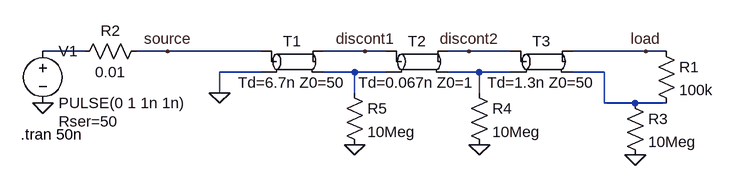
[diagram p0: schematic TransmissionLineReflections.asc]
TransmissionLineReflections.asc, the LTspice schematic file:
Version 4
SHEET 1 880 680
WIRE -160 144 -224 144
WIRE -32 144 -80 144
WIRE 112 144 -32 144
WIRE 272 144 208 144
WIRE 304 144 272 144
WIRE 432 144 400 144
WIRE 496 144 432 144
WIRE 704 144 592 144
WIRE 736 144 704 144
WIRE 112 176 48 176
WIRE 256 176 208 176
WIRE 304 176 256 176
WIRE 448 176 400 176
WIRE 496 176 448 176
WIRE 640 176 592 176
WIRE 48 208 48 176
WIRE 256 208 256 176
WIRE 448 208 448 176
WIRE 640 224 640 176
WIRE 688 224 640 224
WIRE 736 224 688 224
FLAG 48 208 0
FLAG -224 224 0
FLAG 704 144 load
FLAG -32 144 source
FLAG 272 144 discont1
FLAG 432 144 discont2
FLAG 256 288 0
FLAG 448 288 0
FLAG 688 304 0
SYMBOL tline 160 160 R0
SYMATTR InstName T1
SYMATTR Value Td=6.7n Z0=50
SYMBOL tline 352 160 R0
SYMATTR InstName T2
SYMATTR Value Td=0.067n Z0=1
SYMBOL tline 544 160 R0
SYMATTR InstName T3
SYMATTR Value Td=1.3n Z0=50
SYMBOL res 720 128 R0
SYMATTR InstName R1
SYMATTR Value 100k
SYMBOL voltage -224 128 R0
WINDOW 123 0 0 Left 2
WINDOW 39 24 124 Left 2
SYMATTR InstName V1
SYMATTR Value PULSE(0 1 1n 1n)
SYMATTR SpiceLine Rser=50
SYMBOL res -64 128 R90
WINDOW 0 0 56 VBottom 2
WINDOW 3 32 56 VTop 2
SYMATTR InstName R2
SYMATTR Value 0.01
SYMBOL res 672 208 R0
SYMATTR InstName R3
SYMATTR Value 10Meg
SYMBOL res 432 192 R0
SYMATTR InstName R4
SYMATTR Value 10Meg
SYMBOL res 240 192 R0
SYMATTR InstName R5
SYMATTR Value 10Meg
TEXT -258 272 Left 2 !.tran 50n

The netlist it stands for:
* TransmissionLineReflections.asc
T1 source 0 discont1 N002 Td=6.7n Z0=50
T2 discont1 N002 discont2 N003 Td=0.067n Z0=1
T3 discont2 N003 load N004 Td=1.3n Z0=50
R1 load N004 100k
V1 N001 0 PULSE(0 1 1n 1n) Rser=50
R2 source N001 0.01
R3 N004 0 10Meg
R4 N003 0 10Meg
R5 N002 0 10Meg
.tran 50n
.backanno
.end